# EasyEDA Pro project ProDoc_Schematic_PCB_Shield_2026-03-18.epro

# Schematic Schematic1
Board Name: Board2; Create Date: 2026-03-07; Page Name: P1; Project Name: Edge Nexus; Schematic Name: Schematic1; Update Date: 2026-03-07; Company: EasyEDA.com; Page Size: A4; Version: V1.0
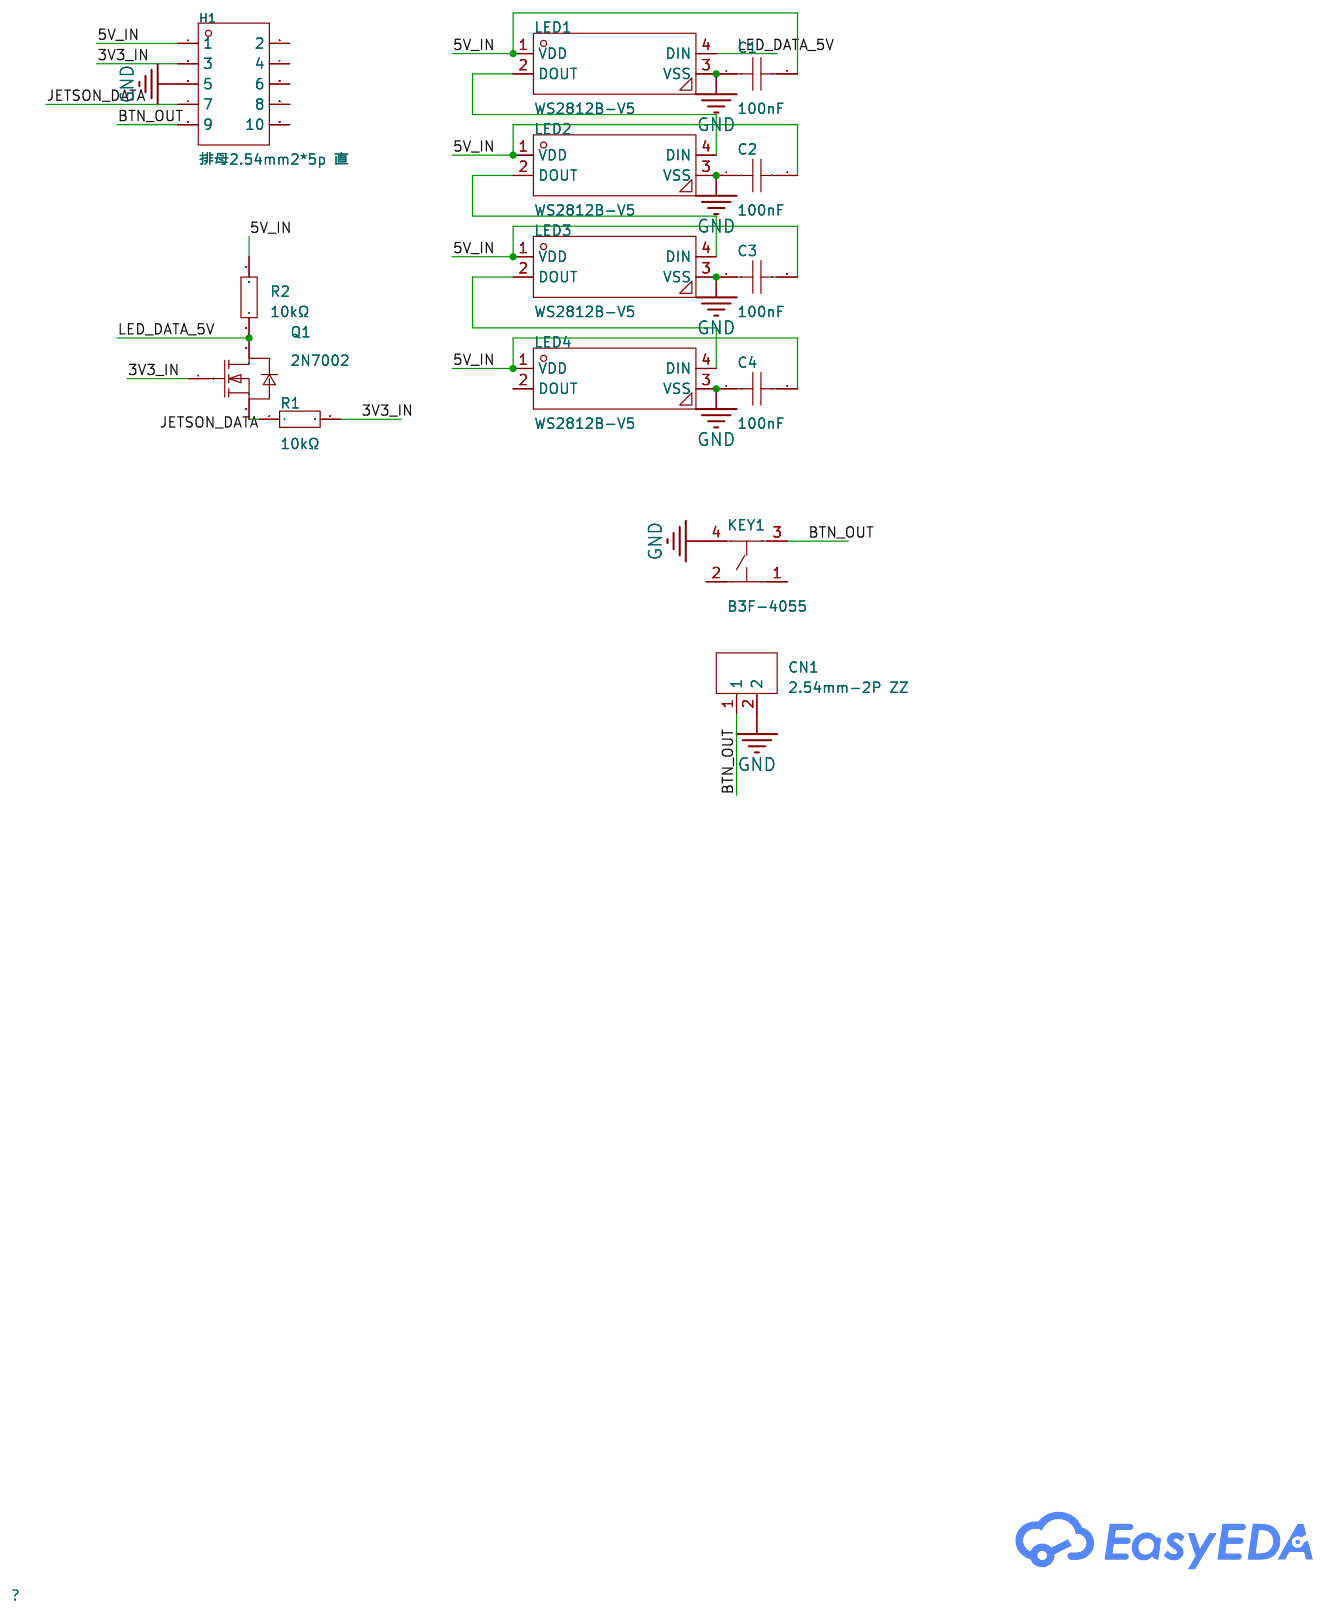
[diagram p0: schematic sheet]

## Parts
C1  100nF  [C1812]
C2  100nF  [C1812]
C3  100nF  [C1812]
C4  100nF  [C1812]
CN1  2.54mm-2P ZZ  [CONN-TH_2.54MM-2P-ZZ]
H1  排母2.54mm2*5p 直  [HDR-TH_10P-P2.54-V-F-R2-C5-S2.54]
KEY1  B3F-4055  [KEY-TH_4P-L12.0-W12.0-P5.00-LS13.4-EH]
LED1  WS2812B-V5  [LED-SMD_4P-L5.0-W5.0-LS5.4-TL-1]
LED2  WS2812B-V5  [LED-SMD_4P-L5.0-W5.0-LS5.4-TL-1]
LED3  WS2812B-V5  [LED-SMD_4P-L5.0-W5.0-LS5.4-TL-1]
LED4  WS2812B-V5  [LED-SMD_4P-L5.0-W5.0-LS5.4-TL-1]
Q1  2N7002  [SOT-23-3_L2.9-W1.3-P1.90-LS2.4-BR]
R1  10kΩ  [RES-TH_BD1.8-L3.2-P7.20-D0.4]
R2  10kΩ  [RES-TH_BD1.8-L3.2-P7.20-D0.4]

## Library data of the parts
C1-C4 = SMDTC03100KB00KP00: Capacitance:100nF Tolerance:±10% Tolerance:±10% Voltage Rating:63V Operating Temperature:-55℃~+105℃ Operating Temperature:-55℃~+105℃; LCSC Part Name: 100nF ±10% 63V; Supplier Part: C19855121; Manufacturer: WIMA; JLCPCB Part Class: Extended Part; Datasheet: https://item.szlcsc.com/datasheet/SMDTC03100KB00KP00/21182571.html; Supplier: LCSC; Tolerance: ±10%; Voltage Rating: 63V; Operating Temperature: -55℃~+105℃
CN1 = 2.54mm-2P ZZ: Pins Structure:1x2P Pitch:2.5mm Mounting Type:Through Hole Reference Series:XH Number of Pins:2P Number of Rows:1 Number of PINs Per Row:2 Row Spacing:- Current Rating:3A Contact Material:Brass Contact Plating:Tin Operating Temperature:-25℃~+85℃ Operating; LCSC Part Name: 2.54-2P直针 白色不耐温; Supplier Part: C5368775; Manufacturer: SHOU HAN(首韩); Supplier Footprint: 插件,P=2.5mm; Datasheet: https://item.szlcsc.com/datasheet/2.54mm-2P%2520ZZ/6208417.html; Supplier: LCSC; Pins Structure: 1x2P; Pitch: 2.5mm; Mounting Type: Through Hole; Reference Series: XH; Number of Pins: 2P; Number of Rows: 1; Number of PINs Per Row: 2; Current Rating: 3A; Contact Material: Brass; Contact Plating: Tin; Operating Temperature: -25℃~+85℃; Voltage Rating: 250V; Plastic Material: PA66; Flame Retardant Rating: UL94V-0; Color: White
H1 = 排母2.54mm2*5p 直: Pitch:2.54mm Row Spacing:2.54mm Circular Hole / Square Hole:Square Hole Mounting Type:Through Hole Number of Rows:2 Number of Positions:10P Holes Direction:Top Insulation Height:- Contact Material:Brass Contact Plating:-; LCSC Part Name: 间距:2.54mm 直插; Supplier Part: C30419; Manufacturer: BOOMELE(博穆精密); Supplier Footprint: 插件,P=2.54mm; JLCPCB Part Class: Extended Part; Supplier: LCSC; Pitch: 2.54mm; Row Spacing: 2.54mm; Circular Hole / Square Hole: Square Hole; Mounting Type: Through Hole; Number of Rows: 2; Number of Positions: 10P; Holes Direction: Top; Contact Material: Brass
KEY1 = B3F-4055_C84931: Circuit:SPST Actuator Style:Rectangular Button Mounting Type:Through Hole Length:12mm Width:12mm Switch Height:7.3mm Contact Current:50mA Voltage Rating:24V With Lamp:- Life:-; LCSC Part Name: 12*12*7.3mm 直插 轻触开关; Supplier Part: C84931; Manufacturer: OMRON(欧姆龙); Supplier Footprint: 插件-4P,12x12mm; Datasheet: https://item.szlcsc.com/datasheet/B3F-4055/86103.html; Supplier: LCSC; Circuit: SPST; Actuator Style: Rectangular Button; Mounting Type: Through Hole; Length: 12mm; Width: 12mm; Switch Height: 7.3mm; Contact Current: 50mA; Voltage Rating: 24V
LED1-LED4 = WS2812B-V5_C2846931: Wavelength:G:520nm；B:471nm；R:621nm Luminous Intensity:B:215mcd；R:310mcd；G:780mcd Fixed-Frequency Pwm Mode:2kHz Data Transmission Rate:800Kbit/s Voltage - Supply:3.7V~5.3V Voltage - Supply:3.7V~5.3V Quiescent Current:0.6mA Operating Temperature:-40℃~+65℃ P; LCSC Part Name: 低噪声运算放大器; Supplier Part: C2846931; Manufacturer: worldsemi; Supplier Footprint: SMD5050-4P; JLCPCB Part Class: Extended Part; Datasheet: https://item.szlcsc.com/datasheet/WS2812B-V5/3042466.html; Supplier: LCSC; Wavelength: G:520nm；B:471nm；R:621nm; Luminous Intensity: B:215mcd；R:310mcd；G:780mcd; Fixed-Frequency Pwm Mode: 2kHz; Data Transmission Rate: 800Kbit/s; Voltage - Supply: 3.7V~5.3V; Quiescent Current: 0.6mA; Operating Temperature: -40℃~+65℃; Peak Wavelength: G:520nm；R:621nm；B:471nm; Length: 5mm; Width: 5mm; Height: 1.57mm
Q1 = 2N7002_C51315010: Supplier Part: C51315010; Manufacturer: CBI(创基); Supplier Footprint: SOT-23; JLCPCB Part Class: Extended Part; Datasheet: https://item.szlcsc.com/datasheet/2N7002/53967148.html; Supplier: LCSC
R1 R2 = MF1/8W-10KΩ±1% T: Type:Metal Film Resistor Resistance:10kΩ Tolerance:±1% Tolerance:±1% Voltage-Supply(Max):150V Power(Watts):125mW Temperature Coefficient:±100ppm/℃ Temperature Coefficient:±100ppm/℃ Operating Temperature:-55℃~+155℃ Operating Temperature:-55℃~+155℃; LCSC Part Name: 10kΩ ±1% 125mW 金属膜电阻 圆柱状直插; Supplier Part: C119202; Manufacturer: CCO(千志电子); Supplier Footprint: 插件,D1.8xL3.2mm; Datasheet: https://item.szlcsc.com/datasheet/MF1%252F8W-10K%25CE%25A9%25C2%25B11%2525%2520T/120471.html; Supplier: LCSC; Type: Metal Film Resistor; Tolerance: ±1%; Voltage-Supply(Max): 150V; Power(Watts): 125mW; Temperature Coefficient: ±100ppm/℃; Operating Temperature: -55℃~+155℃

## Nets
3V3_IN: H1.3 Q1.1(G) R1.2
5V_IN: C1.2 C2.2 C3.2 C4.2 H1.1 LED1.1(VDD) LED2.1(VDD) LED3.1(VDD) LED4.1(VDD) R2.2
GND: C1.1 C2.1 C3.1 C4.1 CN1.2 H1.5 KEY1.4 LED1.3(VSS) LED2.3(VSS) LED3.3(VSS) LED4.3(VSS)
BTN_OUT: CN1.1 H1.9 KEY1.3
JETSON_DATA: H1.7 Q1.2(S) R1.1
LED_DATA_5V: LED1.4(DIN) Q1.3(D) R2.1
Net-(LED1-2): LED1.2(DOUT) LED2.4(DIN)
Net-(LED2-2): LED2.2(DOUT) LED3.4(DIN)
Net-(LED3-2): LED3.2(DOUT) LED4.4(DIN)

Not connected (* = marked no-connect by the designer): H1 2 4 6 8 10; KEY1 1 2; LED4 2(DOUT)
